# EAGLE design Science-Board (EAGLE 7.7.0)
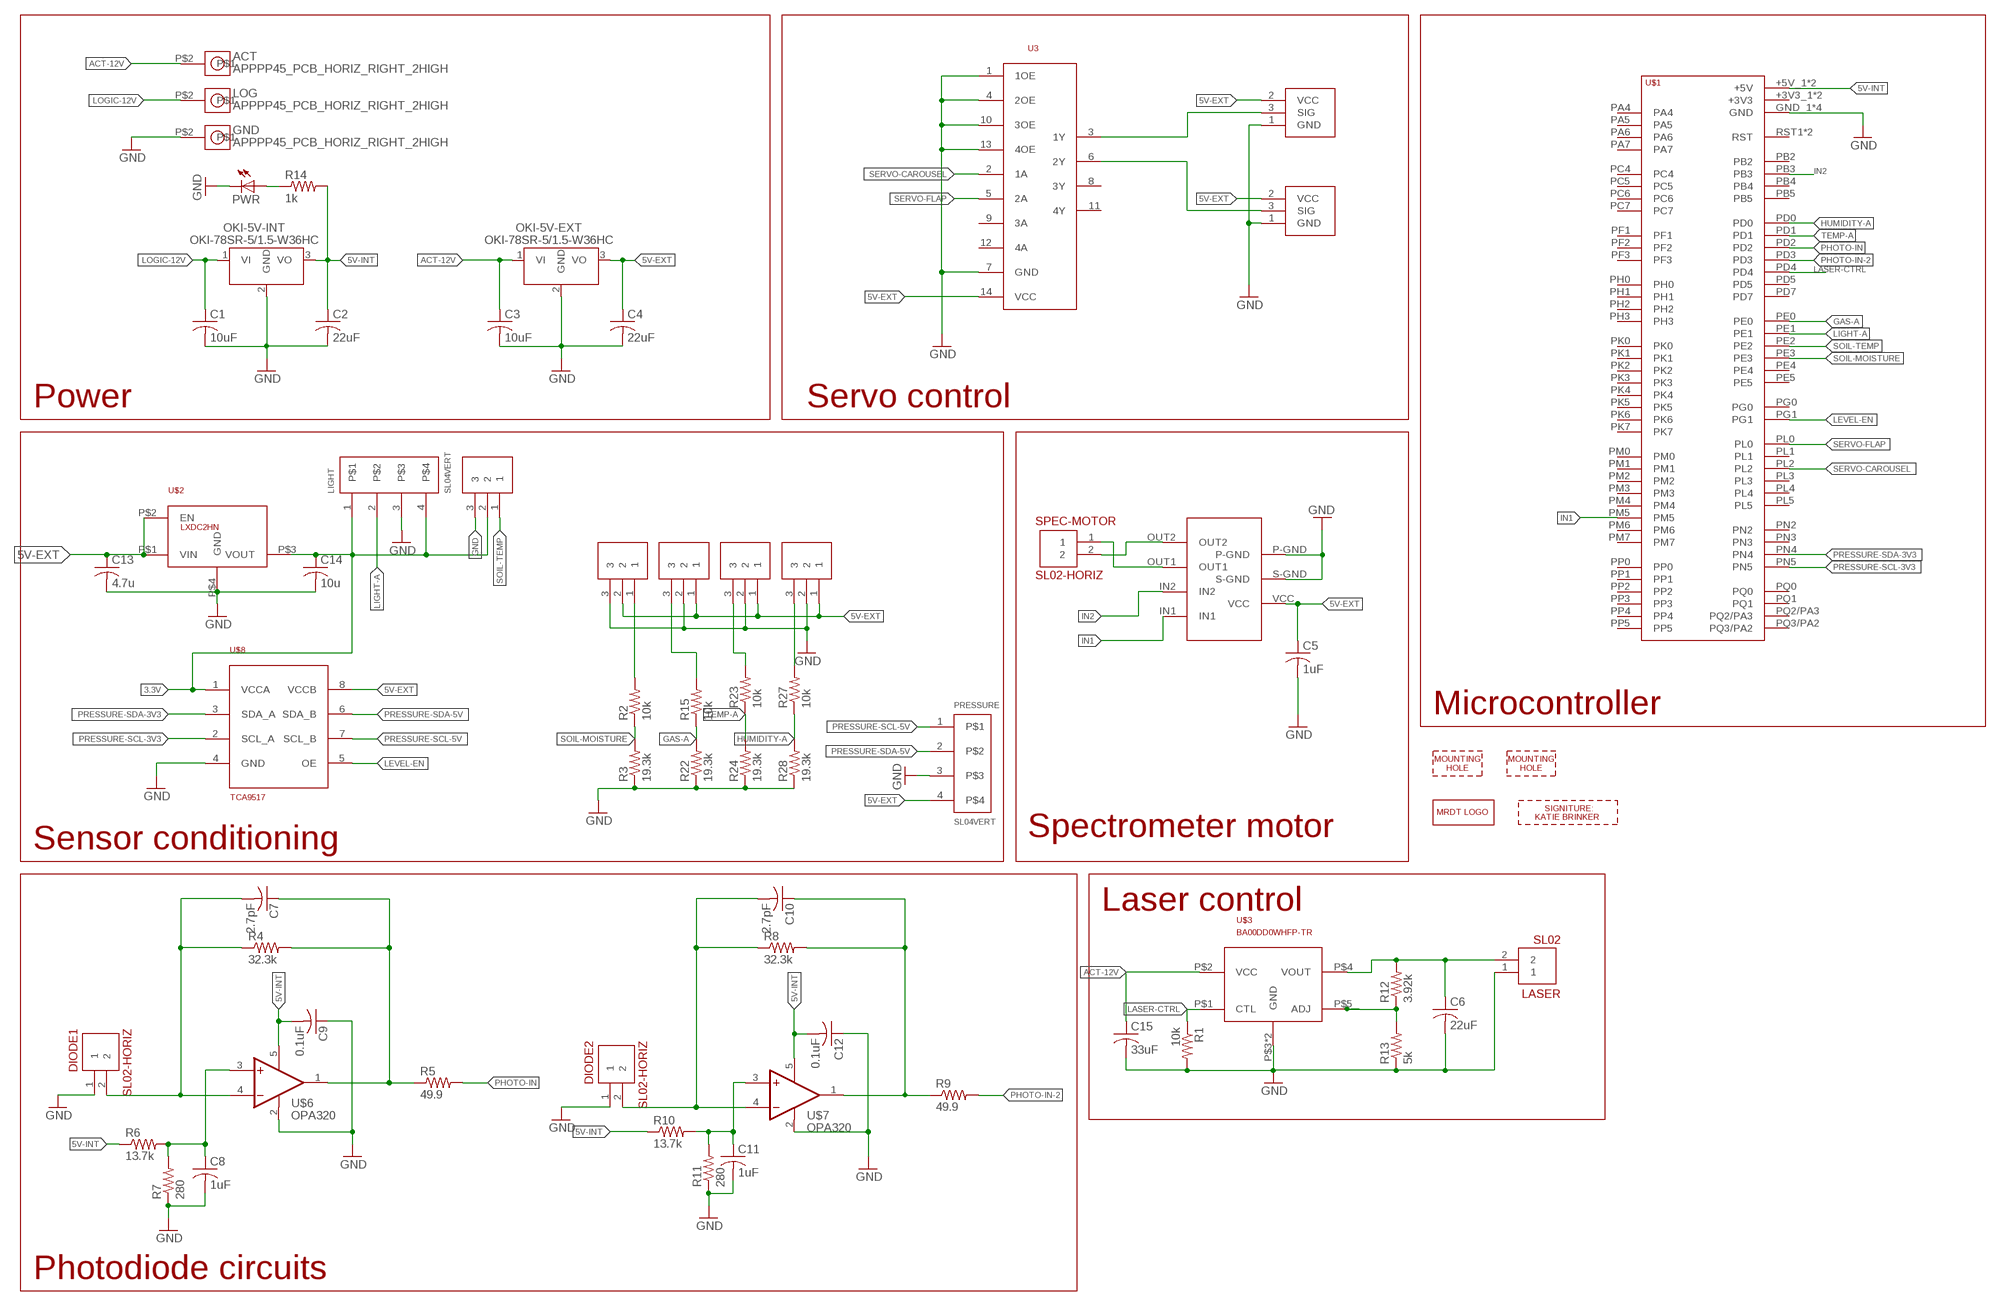
[diagram p0: schematic, sheet 1]

## Parts
ACT  APPPP45_PCB_HORIZ_RIGHT_2HIGH  [APP45_PCB_HORIZ_RIGHT_2HIGH]
C1  10uF  C-USC0805  [C0805]
C2  22uF  C-USC0805  [C0805]
C3  10uF  C-USC0805  [C0805]
C4  22uF  C-USC0805  [C0805]
C5  1uF  C-USC0805  [C0805]
C6  22uF  C-USC0805  [C0805]
C7  2.7pF  C-USC0805  [C0805]
C8  1uF  C-USC0805  [C0805]
C9  0.1uF  C-USC0805  [C0805]
C10  2.7pF  C-USC0805  [C0805]
C11  1uF  C-USC0805  [C0805]
C12  0.1uF  C-USC0805  [C0805]
C13  4.7u  C-USC0805  [C0805]
C14  10u  C-USC0805  [C0805]
C15  33uF  C-USC0805  [C0805]
CAROUSEL  SERVOMOLEX_SL_THRU_HOLE  [MOLEX_SL_03_TH]
DIODE1  SL02-HORIZ  [MOLEX-70551-0001]
DIODE2  SL02-HORIZ  [MOLEX-70551-0001]
FLAP  SERVOMOLEX_SL_THRU_HOLE  [MOLEX_SL_03_TH]
GAS  SL03  [MOLEX-70543-0002]
GND  APPPP45_PCB_HORIZ_RIGHT_2HIGH  [APP45_PCB_HORIZ_RIGHT_2HIGH]
H3  MOUNTING_HOLE#6  [#6_SCREW]
H4  MOUNTING_HOLE#6  [#6_SCREW]
HUMID  SL03  [MOLEX-70543-0002]
LASER  SL02  [MOLEX-70543-0001]
LIGHT  SL04VERT  [MOLEX-70543-0003]
LOG  APPPP45_PCB_HORIZ_RIGHT_2HIGH  [APP45_PCB_HORIZ_RIGHT_2HIGH]
LOGO1  MRDT_LOGO  [MRDT_LOGO]
OKI-5V-EXT  OKI-78SR-5/1.5-W36HC  [OKI-78SR_HORIZ]
OKI-5V-INT  OKI-78SR-5/1.5-W36HC  [OKI-78SR_HORIZ]
PRESSURE  SL04VERT  [MOLEX-70543-0003]
PWR  LEDCHIP-LED0805  [CHIP-LED0805]
R1  10k  R-US_M0805  [M0805]
R2  10k  R-US_R0805  [R0805]
R3  19.3k  R-US_R0805  [R0805]
R4  32.3k  R-US_M0805  [M0805]
R5  49.9  R-US_M0805  [M0805]
R6  13.7k  R-US_M0805  [M0805]
R7  280  R-US_M0805  [M0805]
R8  32.3k  R-US_M0805  [M0805]
R9  49.9  R-US_M0805  [M0805]
R10  13.7k  R-US_M0805  [M0805]
R11  280  R-US_M0805  [M0805]
R12  3.92k  R-US_M0805  [M0805]
R13  5k  R-US_M0805  [M0805]
R14  1k  R-US_M0805  [M0805]
R15  10k  R-US_R0805  [R0805]
R22  19.3k  R-US_R0805  [R0805]
R23  10k  R-US_R0805  [R0805]
R24  19.3k  R-US_R0805  [R0805]
R27  10k  R-US_R0805  [R0805]
R28  19.3k  R-US_R0805  [R0805]
SOIL-MOIST  SL03  [MOLEX-70543-0002]
SOIL-TEMP  SL03  [MOLEX-70543-0002]
SPEC-MOTOR  SL02-HORIZ  [MOLEX-70551-0001]
TEMP  SL03  [MOLEX-70543-0002]
U3  SN74AHCT125  [SOIC14]
U$1  TIVA-1294  [TIVA-C-CONNECTED]
U$2  LXDC2HN  [4-SMD]
U$3  BA00DD0WHFP-TR  [TO-263-6]
U$4  KATIE-BRINKER  [KATIE-BRINKER-SIG]
U$6  OPA320  [SOT-23-5]
U$7  OPA320  [SOT-23-5]
U$8  TCA9517  [SOIC8]
U$10  LB1930MC  [SOIC10]

## Nets
3.3V: C14.1 LIGHT.1 LIGHT.4 SOIL-TEMP.2 U$2.P$3(VOUT) U$8.1(VCCA)
5V-EXT: C4.1 C5.1 C13.1 CAROUSEL.2(VCC) FLAP.2(VCC) GAS.1 HUMID.1 OKI-5V-EXT.3(VO) PRESSURE.4 SOIL-MOIST.2 TEMP.1 U3.14(VCC) U$2.P$1(VIN) U$2.P$2(EN) U$8.8(VCCB) U$10.VCC
5V-INT: C2.1 C9.2 C12.2 OKI-5V-INT.3(VO) R6.1 R10.1 R14.2 U$1.+5V_1(+5V) U$1.+5V_2(+5V) U$6.5(OFF1) U$7.5(OFF1)
ACT-12V: ACT.P$2 C3.1 C15.1 OKI-5V-EXT.1(VI) U$3.P$2(VCC)
GAS-A: R15.1 R22.2 U$1.PE0
GND: C1.2 C2.2 C3.2 C4.2 C5.2 C6.2 C8.2 C9.1 C11.2 C12.1 C13.2 C14.2 C15.2 CAROUSEL.1(GND) DIODE1.1 DIODE2.1 FLAP.1(GND) GAS.2 GND.P$2 HUMID.2 LASER.1 LIGHT.3 OKI-5V-EXT.2(GND) OKI-5V-INT.2(GND) PRESSURE.3 PWR.C R1.2 R3.1 R7.1 R11.1 R13.1 R22.1 R24.1 R28.1 SOIL-MOIST.3 SOIL-TEMP.3 TEMP.2 U3.1(1OE) U3.4(2OE) U3.7(GND) U3.10(3OE) U3.13(4OE) U$1.GND_1(GND) U$1.GND_2(GND) U$1.GND_3(GND) U$1.GND_4(GND) U$2.P$4(GND) U$3.P$3(GND) U$3.P$6(GND) U$6.2(OFF2) U$7.2(OFF2) U$8.4(GND) U$10.P-GND U$10.S-GND
HUMIDITY-A: R27.1 R28.2 U$1.PD0
IN1: U$1.PM5 U$10.IN1
IN2: U$1.PB3 U$10.IN2
LASER-CTRL: R1.1 U$1.PD4 U$3.P$1(CTL)
LEVEL-EN: U$1.PG1 U$8.5(OE)
LIGHT-A: LIGHT.2 U$1.PE1
LOGIC-12V: C1.1 LOG.P$2 OKI-5V-INT.1(VI)
N$1: SPEC-MOTOR.2 U$10.OUT2
N$2: SPEC-MOTOR.1 U$10.OUT1
N$3: C6.1 LASER.2 R12.2 U$3.P$4(VOUT)
N$4: C7.2 DIODE1.2 R4.1 U$6.4(-IN)
N$6: R2.2 SOIL-MOIST.1
N$7: R23.2 TEMP.3
N$8: C7.1 R4.2 R5.1 U$6.1(OUT)
N$9: C10.2 DIODE2.2 R8.1 U$7.4(-IN)
N$10: C8.1 R6.2 R7.2 U$6.3(+IN)
N$11: CAROUSEL.3(SIG) U3.3(1Y)
N$12: FLAP.3(SIG) U3.6(2Y)
N$13: C10.1 R8.2 R9.1 U$7.1(OUT)
N$14: C11.1 R10.2 R11.2 U$7.3(+IN)
N$20: PWR.A R14.1
N$21: GAS.3 R15.2
N$22: HUMID.3 R27.2
N$25: R12.1 R13.2 U$3.P$5(ADJ)
PHOTO-IN: R5.2 U$1.PD2
PHOTO-IN-2: R9.2 U$1.PD3
PRESSURE-SCL-3V3: U$1.PN5 U$8.2(SCL_A)
PRESSURE-SCL-5V: PRESSURE.1 U$8.7(SCL_B)
PRESSURE-SDA-3V3: U$1.PN4 U$8.3(SDA_A)
PRESSURE-SDA-5V: PRESSURE.2 U$8.6(SDA_B)
SERVO-CAROUSEL: U3.2(1A) U$1.PL2
SERVO-FLAP: U3.5(2A) U$1.PL0
SOIL-MOISTURE: R2.1 R3.2 U$1.PE3
SOIL-TEMP: SOIL-TEMP.1 U$1.PE2
TEMP-A: R23.1 R24.2 U$1.PD1
Unconnected: U3.8(3Y) U3.9(3A) U3.11(4Y) U3.12(4A) U$1.+3V3_1(+3V3) U$1.+3V3_2(+3V3) U$1.PA4 U$1.PA5 U$1.PA6 U$1.PA7 U$1.PB2 U$1.PB4 U$1.PB5 U$1.PC4 U$1.PC5 U$1.PC6 U$1.PC7 U$1.PD5 U$1.PD7 U$1.PE4 U$1.PE5 U$1.PF1 U$1.PF2 U$1.PF3 U$1.PG0 U$1.PH0 U$1.PH1 U$1.PH2 U$1.PH3 U$1.PK0 U$1.PK1 U$1.PK2 U$1.PK3 U$1.PK4 U$1.PK5 U$1.PK6 U$1.PK7 U$1.PL1 U$1.PL3 U$1.PL4 U$1.PL5 U$1.PM0 U$1.PM1 U$1.PM2 U$1.PM3 U$1.PM4 U$1.PM6 U$1.PM7 U$1.PN2 U$1.PN3 U$1.PP0 U$1.PP1 U$1.PP2 U$1.PP3 U$1.PP4 U$1.PP5 U$1.PQ0 U$1.PQ1 U$1.PQ2/PA3 U$1.PQ3/PA2 U$1.RST1(RST) U$1.RST_2(RST)

## Notes on the sheet
- Power | Servo control
- Microcontroller
- Spectrometer motor
- Sensor conditioning
- Laser control
- Photodiode circuits

## Library data of the parts
ACT GND LOG = MRDT-Connectors:APP: http://www.powerwerx.com/anderson-powerpoles/
C1-C15 = rcl:C-US: CAPACITOR, American symbol
CAROUSEL FLAP = MRDT-Connectors:SERVO; ORIENT: HORIZ; PARTNO: 0705550002
DIODE1 DIODE2 LASER SPEC-MOTOR = MRDT-Connectors:SL02
GAS HUMID SOIL-MOIST SOIL-TEMP TEMP = MRDT-Connectors:SL03: Molex 3-pin SL connector Locking 3 pin connector with standard header spacing. Backward compatible with standard RC servo connectors.
H3 H4 = MRDT-Hardware:MOUNTING_HOLE: Mounting hole for M6 bolt. Standard use mounting hole for: Tiva C Connected - M6 Anderson Powerpole Mounting Wing - M8 Most frame-mounted PCB's - M8
LIGHT PRESSURE = MRDT-Connectors:SL04
LOGO1 = MRDT-Hardware:MRDT_LOGO
OKI-5V-EXT OKI-5V-INT = MRDT-ICs:OKI-78SR-*/1.5-W36?C: 4.95W DC/DC Converter Manufacturer: Murata; VOUT: +5v
PWR = led:LED: LED OSRAM: - CHIPLED LG R971, LG N971, LY N971, LG Q971, LY Q971, LO R971, LY R971 LH N974, LH R974 LS Q976, LO Q976, LY Q976 LO Q996 - Hyper CHIPLED LW Q18S LB Q993, LB Q99A, LB R99A - SideLED LS A670, LO A670, LY A670, LG A670, LP A670 LB A673, LV A673, LT A673, LW A673 LH A674 LY A675 LS A676, LA A676, LO A676, LY A676, LW A676 LS A679, LY A679, LG A679 - Hyper Micro SIDELED® LS Y876, LA Y876, LO Y876, LY Y876 LT Y87S - SmartLED LW L88C, LW L88S LB L89C, LB L89S, LG L890 LS L89K, LO L89K, LY L89K LS L896, LA L896, LO L896, LY L896 - TOPLED LS T670, LO T670, LY T670, LG T670, LP T670 LSG T670, LSP T670, LSY T670, LOP T670, LYG T670 LG T671, LOG T671, LSG T671 LB T673, LV T673, LT T673, LW T673 LH T674 LS T676, LA T676, LO T676, LY T676, LB T676, LH T676, LSB T676, LW T676 LB T67C, LV T67C, LT T67C, LS T67K, LO T67K, LY T67K, LW E67C LS E67B, LA E67B, LO E67B, LY E67B, LB E67C, LV E67C, LT E67C LW T67C LS T679, LY T679, LG T679 LS T770, LO T770, LY T770, LG T770, LP T770 LB T773, LV T773, LT T773, LW T773 LH T774 LS E675, LA E675, LY E675, LS T675 LS T776, LA T776, LO T776, LY T776, LB T776 LHGB T686 LT T68C, LB T68C - Hyper Mini TOPLED® LB M676 - Mini TOPLED Santana® LG M470 LS M47K, LO M47K, LY M47K Source: http://www.osram.convergy.de LUXEON: - LUMILED® LXK2-PW12-R00, LXK2-PW12-S00, LXK2-PW14-U00, LXK2-PW14-V00 LXK2-PM12-R00, LXK2-PM12-S00, LXK2-PM14-U00 LXK2-PE12-Q00, LXK2-PE12-R00, LXK2-PE12-S00, LXK2-PE14-T00, LXK2-PE14-U00 LXK2-PB12-K00, LXK2-PB12-L00, LXK2-PB12-M00, LXK2-PB14-N00, LXK2-PB14-P00, LXK2-PB14-Q00 LXK2-PR12-L00, LXK2-PR12-M00, LXK2-PR14-Q00, LXK2-PR14-R00 LXK2-PD12-Q00, LXK2-PD12-R00, LXK2-PD12-S00 LXK2-PH12-R00, LXK2-PH12-S00 LXK2-PL12-P00, LXK2-PL12-Q00, LXK2-PL12-R00 Source: www.luxeon.com KINGBRIGHT: KA-3528ASYC Source: www.kingbright.com
R1-R15 R22-R24 R27 R28 = rcl:R-US_: RESISTOR, American symbol
U3 = MRDT-ICs:SN74AHCT125: part # SN74AHCT125 QUADRUPLE BUS BUFFER GATES WITH 3-STATE OUTPUTS http://www.digikey.com/product-detail/en/SN74AHCT125DR/296-4652-1-ND/405208; PARTNO: SN74AHCT125
U$1 = MRDT-Microcontrollers:TIVA-1294: TIVA C CONNECTED LAUNCHPAD
U$2 = MRDT-ICs:LXDC2HN
U$3 = MRDT-ICs:BA00DD0WHFP-TR
U$4 = sig:KATIE-BRINKER
U$6 U$7 = MRDT-ICs:OPA320
U$8 = MRDT-ICs:TCA9517: TCA9517 Level-Shifting I2C Bus Repeater
U$10 = Custom:LB1930MC

## Board
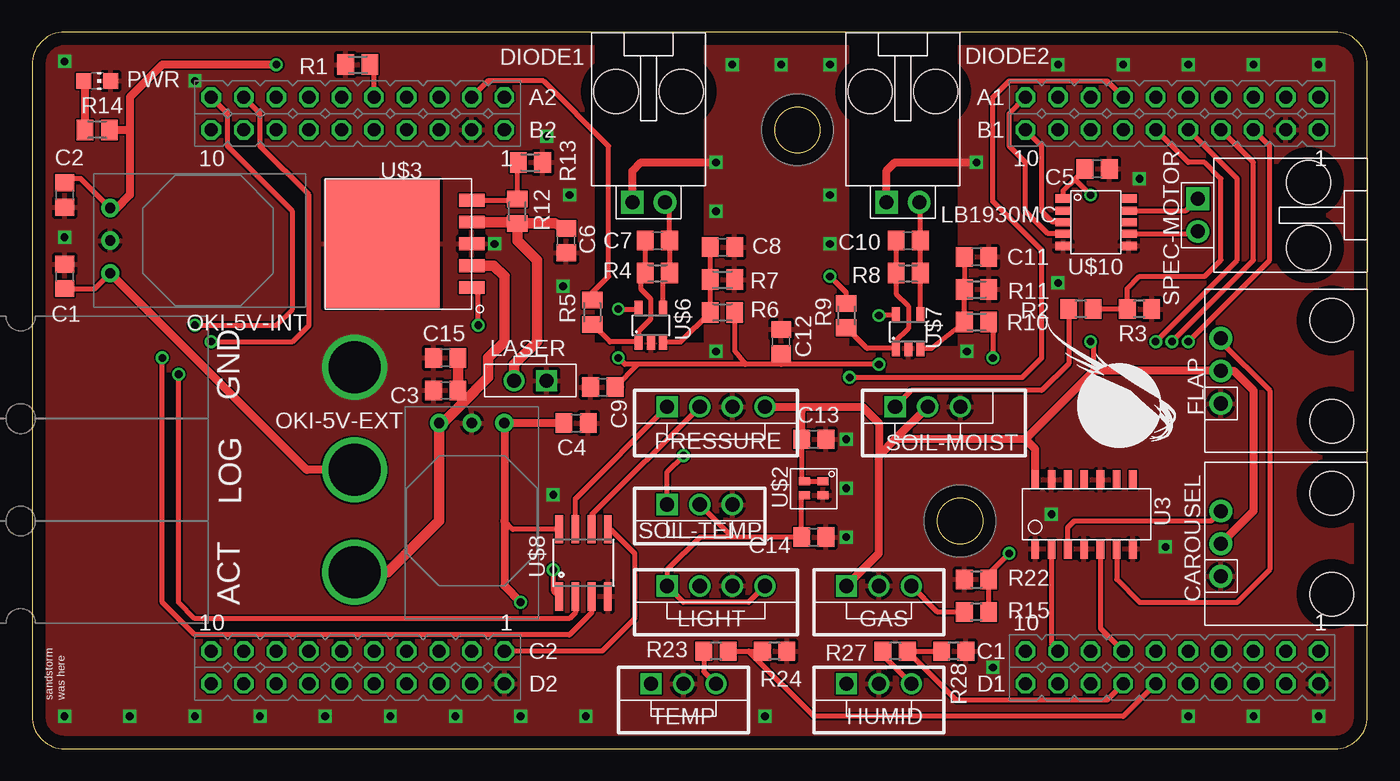
[diagram p1: board, top side]
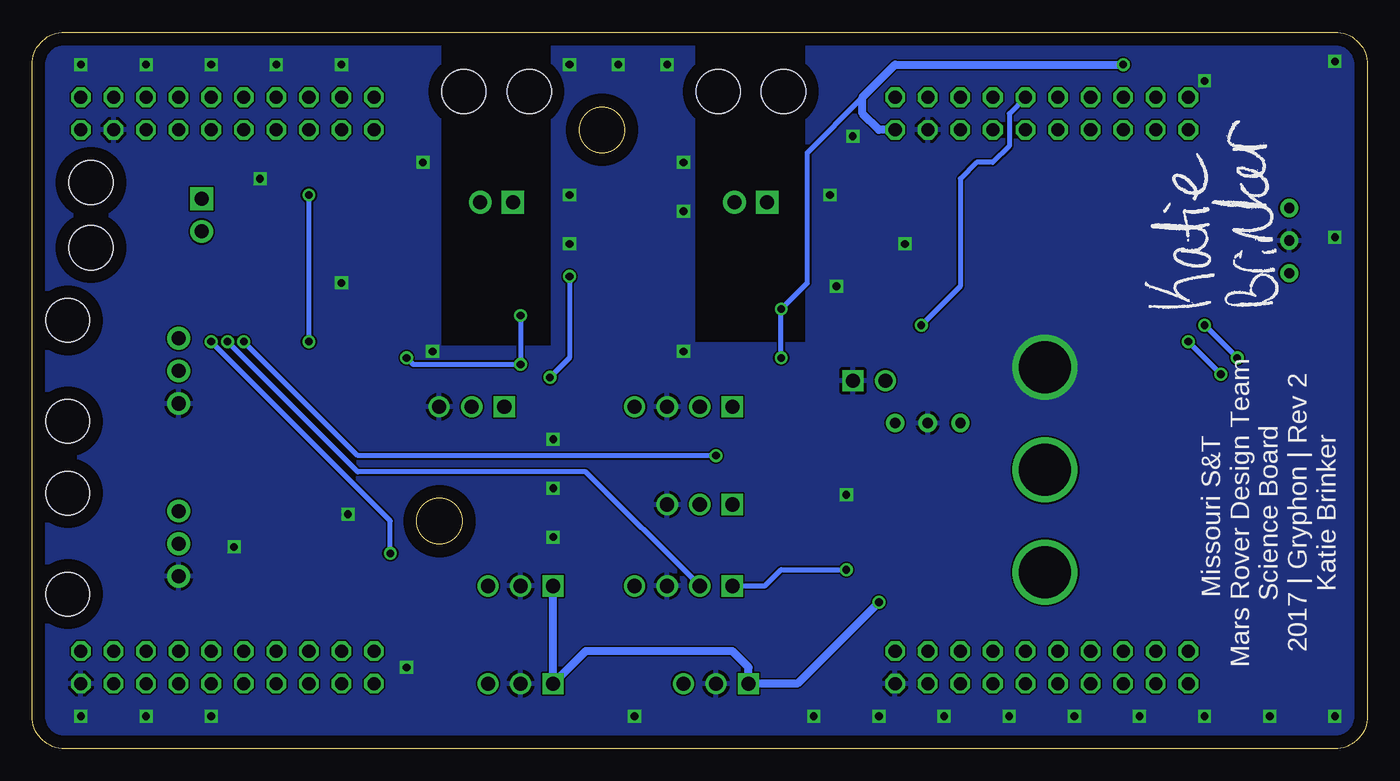
[diagram p2: board, bottom side, seen from below]

Size 104.14 x 55.88 mm. Coordinates in mm from the lower left corner, seen from the top.
Outline: 0,53.34 0,2.54 arc90 2.54,0 101.6,0 arc90 104.14,2.54 104.14,53.34 arc90 101.6,55.88 2.54,55.88 arc90 0,53.34
Copper layers (1*16): Top 0.035mm / dielectric 1.5mm / Bottom 0.035mm
Design rules "advanced_circuits_standard": minimum track width 5mil, minimum drill 10mil, track to track 5mil, track to pad 5mil, pad to pad 5mil, via to via 5mil, smd to smd 5mil, copper to edge 40mil, drill to drill 5mil, minimum pad ring 10mil, minimum via ring 8mil, stop-mask expansion 4mil, vias tented up to drill 0mil, thermal gap 10mil

### Footprints (pad centres in the part's own frame; a part is rotated, then mirrored left to right if it is on the bottom)
APP45_PCB_HORIZ_RIGHT_2HIGH = drill 4.064: P$2 36.068,3.969
C0805 = smd 1.3 x 1.5: 1 -0.95,0; 2 0.95,0
MOLEX_SL_03_TH = drill 1.092 pad 1.778: 1 2.54,0; 2 0,0; 3 -2.54,0 | hole 3.404: -3.937,8.636; 3.937,8.636
MOLEX-70551-0001 = drill 1.092 pad 1.778 square: 1 -1.27,0 | drill 1.092 pad 1.778: 2 1.27,0 | hole 3.454: -2.54,8.636; 2.54,8.636
MOLEX-70543-0002 = drill 1.1 square: 1 2.54,0 | drill 1.1: 2 0,0; 3 -2.54,0
MOLEX-70543-0001 = drill 1.1 square: 1 1.27,0 | drill 1.1: 2 -1.27,0
MOLEX-70543-0003 = drill 1.1 square: 1 3.81,0 | drill 1.1: 2 1.27,0; 3 -1.27,0; 4 -3.81,0
OKI-78SR_HORIZ = drill 0.8 pad 1.422: 1 0,0; 2 -2.54,0; 3 -5.08,0
CHIP-LED0805 = smd 1.2 x 1.2: A 0,-1.05; C 0,1.05
M0805 = smd 1.3 x 1.6: 1 -0.95,0; 2 0.95,0
R0805 = smd 1.3 x 1.5: 1 -0.95,0; 2 0.95,0
SOIC14 = smd 1.5 x 0.6: 1 1.11,10.16; 2 1.11,8.89; 3 1.11,7.62; 4 1.11,6.35; 5 1.11,5.08; 6 1.11,3.81; 7 1.11,2.54; 8 6.51,2.54; 9 6.51,3.81; 10 6.51,5.08; 11 6.51,6.35; 12 6.51,7.62; 13 6.51,8.89; 14 6.51,10.16
TIVA-C-CONNECTED = drill 1.016 octagon: +3V3_1 59.69,54.61; +3V3_2 123.19,54.61; +5V_1 59.69,52.07; +5V_2 123.19,52.07; GND_1 57.15,52.07; GND_2 59.69,8.89; GND_3 120.65,52.07; GND_4 123.19,8.89; PA4 39.37,52.07; PA5 36.83,52.07; PA6 105.41,52.07; PA7 52.07,8.89; PB2 102.87,54.61; PB3 100.33,54.61; PB4 54.61,52.07; PB5 52.07,52.07; PC4 118.11,54.61; PC5 115.57,54.61; PC6 113.03,54.61; PC7 105.41,54.61; PD0 107.95,8.89; PD1 110.49,8.89; PD2 57.15,54.61; PD3 107.95,54.61; PD4 49.53,54.61; PD5 46.99,54.61; PD7 107.95,52.07; PE0 118.11,52.07; PE1 115.57,52.07; PE2 113.03,52.07; PE3 110.49,52.07; PE4 120.65,54.61; PE5 110.49,54.61; PF1 123.19,11.43; PF2 120.65,11.43; PF3 118.11,11.43; PG0 115.57,11.43; PG1 59.69,11.43; PH0 44.45,11.43; PH1 41.91,11.43; PH2 118.11,8.89; PH3 115.57,8.89; PK0 49.53,52.07; PK1 46.99,52.07; PK2 44.45,52.07; PK3 41.91,52.07; PK4 57.15,11.43; PK5 54.61,11.43; PK6 39.37,11.43; PK7 36.83,11.43; PL0 107.95,11.43; PL1 105.41,11.43; PL2 102.87,11.43; PL3 100.33,11.43; PL4 113.03,11.43; PL5 110.49,11.43; PM0 52.07,11.43; PM1 49.53,11.43; PM2 46.99,11.43; PM3 120.65,8.89; PM4 102.87,52.07; PM5 100.33,52.07; PM6 36.83,8.89; PM7 57.15,8.89; PN2 105.41,8.89; PN3 102.87,8.89; PN4 36.83,54.61; PN5 39.37,54.61; PP0 54.61,54.61; PP1 52.07,54.61; PP2 100.33,8.89; PP3 41.91,8.89; PP4 41.91,54.61; PP5 54.61,8.89; PQ0 44.45,54.61; PQ1 39.37,8.89; PQ2/PA3 46.99,8.89; PQ3/PA2 44.45,8.89; RST1 49.53,8.89; RST_2 113.03,8.89
4-SMD = smd 0.85 x 0.6: P$1 0.725,0.55; P$2 -0.725,0.55; P$3 -0.725,-0.55; P$4 0.725,-0.55
TO-263-6 = smd 1 x 2: P$1 -3.4,0; P$2 -1.7,0; P$3 0,0; P$4 1.7,0; P$5 3.4,0 | smd 10 x 9: P$6 0,7
SOT-23-5 = smd 0.62 x 1.22: 1 -0.95,-1.3; 2 0,-1.3; 3 0.95,-1.3; 4 0.95,1.3; 5 -0.95,1.3
SOIC8 = smd 0.6 x 2.2: 1 0.457,-0.813; 2 1.727,-0.813; 3 2.997,-0.813; 4 4.267,-0.813; 5 4.267,4.419; 6 2.997,4.419; 7 1.727,4.419; 8 0.457,4.419
SOIC10 = smd 1.27 x 0.635: IN1 -0.6,2.45; IN2 -0.6,1.55; NC1 4.5,4.3; NC2 -0.6,3.35; NC3 4.5,2.45; OUT1 4.5,3.35; OUT2 4.5,1.55; P-GND 4.5,0.6; S-GND -0.6,0.6; VCC -0.6,4.3

### Placement (x,y rotation side)
ACT  -10.92,9.8 0 top
C1  2.54,36.83 90 top
C2  2.54,43.18 270 top
C3  32.26,27.94 180 top
C4  42.42,25.4 0 top
C5  83.06,45.21 0 top
C6  41.66,39.62 270 top
C7  48.77,39.62 0 top
C8  53.85,39.12 0 top
C9  44.51,28.2 0 top
C10  68.33,39.62 0 top
C11  73.66,38.35 0 top
C12  58.42,31.75 270 top
C13  60.96,24.13 0 top
C14  60.96,16.51 0 top
C15  32.26,30.48 180 top
CAROUSEL  92.71,16 270 top
DIODE1  48.08,42.61 0 top
DIODE2  67.92,42.62 0 top
FLAP  92.71,29.46 270 top
GAS  66.04,12.7 180 top
GND  -10.92,25.78 0 top
H3  59.69,48.26 0 top
H4  72.36,17.75 0 top
HUMID  66.04,5.08 180 top
LASER  38.86,28.7 0 top
LIGHT  53.34,12.7 180 top
LOG  -10.92,17.78 0 top
LOGO1  90.06,23.46 90 top
OKI-5V-EXT  31.75,25.4 180 top
OKI-5V-INT  6.1,37.08 270 top
PRESSURE  53.34,26.67 180 top
PWR  5.08,52.07 270 top
R1  25.4,53.34 180 top
R2  81.79,34.29 180 top
R3  86.36,34.29 180 top
R4  48.77,37.08 180 top
R5  43.69,34.04 90 top
R6  53.85,34.04 180 top
R7  53.85,36.58 180 top
R8  68.33,37.08 180 top
R9  63.5,33.78 90 top
R10  73.66,33.27 180 top
R11  73.66,35.81 180 top
R12  37.85,41.91 270 top
R13  38.86,45.72 180 top
R14  5.08,48.26 0 top
R15  73.66,10.67 180 top
R22  73.66,13.21 0 top
R23  53.34,7.62 180 top
R24  57.91,7.62 180 top
R27  67.31,7.62 180 top
R28  71.88,7.62 180 top
SOIL-MOIST  69.85,26.67 180 top
SOIL-TEMP  52.07,19.05 180 top
SPEC-MOTOR  90.91,41.61 270 top
TEMP  50.8,5.08 180 top
U3  88.39,14.48 90 top
U$1  -22.86,-3.81 0 top
U$2  60.96,20.32 0 top
U$3  34.29,39.37 90 top
U$4  7.11,34.29 90 bottom
U$6  48.26,33.02 0 top
U$7  68.33,32.51 0 top
U$8  40.64,12.7 0 top
U$10  81.03,38.61 0 top

### Tracks (layer width: path | path; a pad name or v marks a point on that pad's centre or on a via)
3.3V  (via drill 0.6)
  Top 0.406: U$2.P$3 60.01,19.55 C14.1 54.61,16.51 | 54.61,16.51 SOIL-TEMP.2 | 54.61,16.51 52.07,16.51 49.53,13.97 LIGHT.1 50.8,11.43 55.88,11.43 LIGHT.4 | v40.64,13.97 40.64,12.34 U$8.1
  Bottom 0.406: LIGHT.1 46.99,12.7 45.72,13.97 v40.64,13.97
5V-EXT  (via drill 0.6)
  Top 0.406: U$10.VCC 80.43,43.53 81.31,44.42 | 81.31,44.42 C5.1 | 82.8,29.46 82.8,31.5 v82.55,31.75 | v82.55,43.18 81.31,44.42 | U$8.8 37.49,17.12 36.83,17.78 | C13.1 60.01,21.09 U$2.P$2 U$2.P$1
  Top 0.61: GAS.1 66.04,15.24 66.04,22.86 | 67.31,24.13 SOIL-MOIST.2 | 77.47,24.13 82.8,29.46 FLAP.2 93.73,29.46 95.25,27.94 95.25,18.54 CAROUSEL.2 | 77.47,24.13 67.31,24.13 | 67.31,24.13 66.04,22.86 | U3.14 78.23,23.37 77.47,24.13 | v38.1,11.43 36.83,12.7 36.83,17.78 OKI-5V-EXT.3 C4.1 | PRESSURE.4 59.69,26.67 | C13.1 60.01,26.35 59.69,26.67 | 59.69,26.67 64.77,26.67 66.04,25.4 66.04,22.86
  Bottom 0.406: v82.55,31.75 v82.55,43.18
  Bottom 0.61: GAS.1 HUMID.1 60.96,7.62 49.53,7.62 48.26,6.35 TEMP.1 44.45,5.08 v38.1,11.43
5V-INT  (via drill 0.6)
  Top 0.406: OKI-5V-INT.3 3.81,44.45 2.86,44.45 C2.1 | v66.04,29.97 58.42,29.97 | 58.42,29.97 55.63,29.97 | 55.63,29.97 47.23,29.97 | 45.98,28.2 C9.2 47.23,29.97 | R6.1 54.8,31.05 55.63,29.97 | U$7.5 66.52,33.81 v66.04,33.78 | 47.23,29.97 46.23,29.97 v45.72,30.48 | v74.93,30.48 74.97,30.52 74.97,32.92 R10.1 | v45.72,34.29 47.28,34.29 U$6.5 | C12.2 58.42,29.97
  Top 0.61: v19.05,53.34 10.16,53.34 7.62,50.8 7.62,48.26 | 7.62,48.26 7.62,43.18 6.6,42.16 OKI-5V-INT.3 | R14.2 7.62,48.26
  Bottom 0.406: 39.37,50.8 43.69,46.48 43.69,36.32 v45.72,34.29 v45.72,30.48 | v66.04,33.78 v66.04,29.97 74.42,29.97 v74.93,30.48
  Bottom 0.61: U$1.+5V_1 38.1,48.26 39.37,49.53 39.37,50.8 36.83,53.34 v19.05,53.34
ACT-12V
  Top 0.813: ACT.P$2 27.74,13.77 31.75,17.78 OKI-5V-EXT.1 32,25.4 33.53,26.92 | C15.1 C3.1 33.53,27.62 33.53,26.92 | U$3.P$2 35.99,37.67 36.83,36.83 36.83,31.75 35.56,30.48 35.56,28.96 33.53,26.92
GAS-A  (via drill 0.6)
  Top 0.406: R15.1 R22.2 74.61,13.65 v76.2,15.24 | v90.17,31.75 96.52,38.1 96.52,46.99 U$1.PE0
  Bottom 0.406: v76.2,15.24 76.2,17.78 v90.17,31.75
GND  (via drill 0.6)
  Top 0.61: DIODE1.1 46.81,45.03 47.5,45.72 v53.34,45.72 | DIODE2.1 66.65,45.06 67.31,45.72 v73.66,45.72
  other vias: 100.33,53.34 95.25,53.34 90.17,53.34 85.09,53.34 80.01,53.34 58.42,53.34 54.61,53.34 36.07,39.37 12.7,52.07 2.54,53.59 2.54,39.88 40.64,19.81 57.15,2.54 74.93,6.35 79.5,18.29 63.5,16.51 63.5,20.32 80.01,36.32 86.36,44.45 100.33,2.54 95.25,2.54 90.17,2.54 2.54,2.54 7.62,2.54 12.7,2.54 17.78,2.54 22.86,2.54 27.94,2.54 33.02,2.54 38.1,2.54 43.18,2.54 40.13,47.75 63.5,24.13 53.34,30.99 72.9,30.99 62.23,53.34 62.23,43.18 53.34,41.91 62.23,39.37 41.91,43.18 41.4,36.07 88.39,15.75
  pour Top: -5.08,58.42 43.69,58.42 43.69,31.5 52.58,31.5 52.58,59.69 63.5,59.69 63.5,31.24 72.39,31.24 72.39,59.69 107.95,59.69 107.95,-5.08 -5.08,-5.08
  pour Bottom: -5.08,58.42 43.69,58.42 43.69,31.5 52.58,31.5 52.58,59.69 63.5,59.69 63.5,31.24 72.39,31.24 72.39,59.69 107.95,59.69 107.95,-5.08 -5.08,-5.08
HUMIDITY-A
  Top 0.406: R28.2 R27.1 72.07,3.81 83.82,3.81 U$1.PD0
IN1
  Top 0.406: U$10.IN1 79.59,41.06 78.74,41.91 78.74,46.99 U$1.PM5
IN2
  Top 0.406: U$10.IN2 79.22,40.16 77.47,41.91 77.47,45.72 76.2,46.99 76.2,49.53 U$1.PB3
LASER-CTRL  (via drill 0.6)
  Top 0.406: U$1.PD4 26.67,53.02 R1.1 | v34.8,33.02 34.8,35.46 U$3.P$1
  Bottom 0.406: U$1.PD4 27.94,49.53 27.94,46.99 29.21,45.72 30.48,45.72 31.75,44.45 31.75,36.07 v34.8,33.02
LEVEL-EN
  Top 0.406: U$8.5 45.11,17.12 46.99,15.24 46.99,10.16 44.45,7.62 U$1.PG1
LIGHT-A  (via drill 0.6)
  Top 0.406: v88.9,31.75 95.25,38.1 95.25,45.72 U$1.PE1
  Bottom 0.406: v88.9,31.75 78.74,21.59 60.96,21.59 LIGHT.2
LOGIC-12V
  Top 0.406: C1.1 4.89,35.88 OKI-5V-INT.1
  Top 0.61: LOG.P$2 21.43,21.75 OKI-5V-INT.1
N$1
  Top 0.406: U$10.OUT2 90.73,40.16 SPEC-MOTOR.2
N$2
  Top 0.406: U$10.OUT1 89.99,41.96 SPEC-MOTOR.1
N$3
  Top 0.813: U$3.P$4 37.74,41.07 R12.2 | R12.2 40.76,40.96 C6.1 | R12.2 37.85,39.62 39.37,38.1 39.37,31.75 37.59,29.97 LASER.2
N$4
  Top 0.406: DIODE1.2 49.72,42.24 C7.2 R4.1 49.21,36.58 U$6.4
N$6
  Top 0.406: R2.2 80.84,30.04 78.74,27.94 68.58,27.94 SOIL-MOIST.1
N$7
  Top 0.406: R23.2 52.39,6.03 TEMP.3
N$8
  Top 0.406: C7.1 R4.2 47.5,36.76 47.5,35.81 48.26,35.05 48.26,33.53 47.34,32.6 U$6.1 45.05,31.72 R5.1
N$9
  Top 0.406: U$7.4 R8.1 C10.2 69.28,42.53 DIODE2.2
N$10
  Top 0.406: C8.1 R7.2 R6.2 50.58,31.72 U$6.3
N$11
  Top 0.406: U3.3 80.77,17.27 81.28,17.78 91.95,17.78 CAROUSEL.3
N$12
  Top 0.406: FLAP.3 92.71,31.75 96.52,27.94 96.52,13.97 93.98,11.43 86.36,11.43 84.58,13.21 U3.6
N$13
  Top 0.406: R9.1 65.12,31.21 U$7.1 67.31,31.28 67.31,31.75 68.33,32.77 68.33,34.54 67.38,35.49 R8.2 C10.1
N$14
  Top 0.406: C11.1 R11.2 R10.2 70.14,31.21 U$7.3
N$20
  Top 0.61: R14.1 4.13,51.97 PWR.A
N$21
  Top 0.406: R15.2 70.61,10.67 GAS.3
N$22
  Top 0.406: R27.2 66.36,7.3 HUMID.3
N$25
  Top 0.406: U$3.P$5 37.76,42.77 R12.1 37.85,45.65 R13.2
PHOTO-IN
  Top 0.406: R5.2 43.69,35.56 44.96,36.83 44.96,46.99 39.88,52.07 35.56,52.07 U$1.PD2
PHOTO-IN-2  (via drill 0.6)
  Top 0.406: R9.2 63.5,35.56 v62.23,36.83 | v63.75,28.96 77.22,28.96 78.74,30.48 78.74,38.86 74.93,42.67 74.93,50.8 76.2,52.07 83.82,52.07 U$1.PD3
  Bottom 0.406: v62.23,36.83 62.23,30.48 v63.75,28.96
PRESSURE-SCL-3V3  (via drill 0.6)
  Top 0.406: v11.43,29.21 11.43,11.43 12.7,10.16 41.91,10.16 42.37,10.62 U$8.2 | v13.97,31.75 20.32,31.75 21.59,33.02 21.59,43.18 17.78,46.99 17.78,49.53 U$1.PN5
  Bottom 0.406: v11.43,29.21 v13.97,31.75
PRESSURE-SCL-5V
  Top 0.406: U$8.7 42.37,19.51 PRESSURE.1
PRESSURE-SDA-3V3  (via drill 0.6)
  Top 0.406: U$8.3 43.64,10.62 41.91,8.89 12.7,8.89 10.16,11.43 v10.16,30.48 | v12.7,33.02 19.05,33.02 20.32,34.29 20.32,41.91 15.24,46.99 15.24,49.53 U$1.PN4
  Bottom 0.406: v10.16,30.48 v12.7,33.02
PRESSURE-SDA-5V
  Top 0.406: U$8.6 43.64,18.24 PRESSURE.2
SERVO-CAROUSEL
  Top 0.406: U3.2 79.5,8.13 U$1.PL2
SERVO-FLAP
  Top 0.406: U3.5 83.31,9.4 U$1.PL0
SOIL-MOISTURE
  Top 0.406: R2.1 R3.2 85.41,35.88 86.36,36.83 91.44,36.83 92.71,38.1 92.71,44.45 91.44,45.72 90.17,45.72 U$1.PE3
SOIL-TEMP  (via drill 0.6)
  Top 0.406: SOIL-TEMP.1 49.53,21.59 v50.8,22.86 | v87.63,31.75 93.98,38.1 93.98,44.45 U$1.PE2
  Bottom 0.406: v50.8,22.86 78.74,22.86 v87.63,31.75
TEMP-A
  Top 0.406: R23.1 55.88,7.62 | 55.88,7.62 R24.2 | U$1.PD1 85.09,2.54 60.96,2.54 55.88,7.62

### Text on the board
tPlace: sandstorm / was here
tNames: GND | LOG | ACT
bNames: Missouri S&T / Mars Rover Design Team / Science Board / 2017 | Gryphon | Rev 2 / Katie Brinker